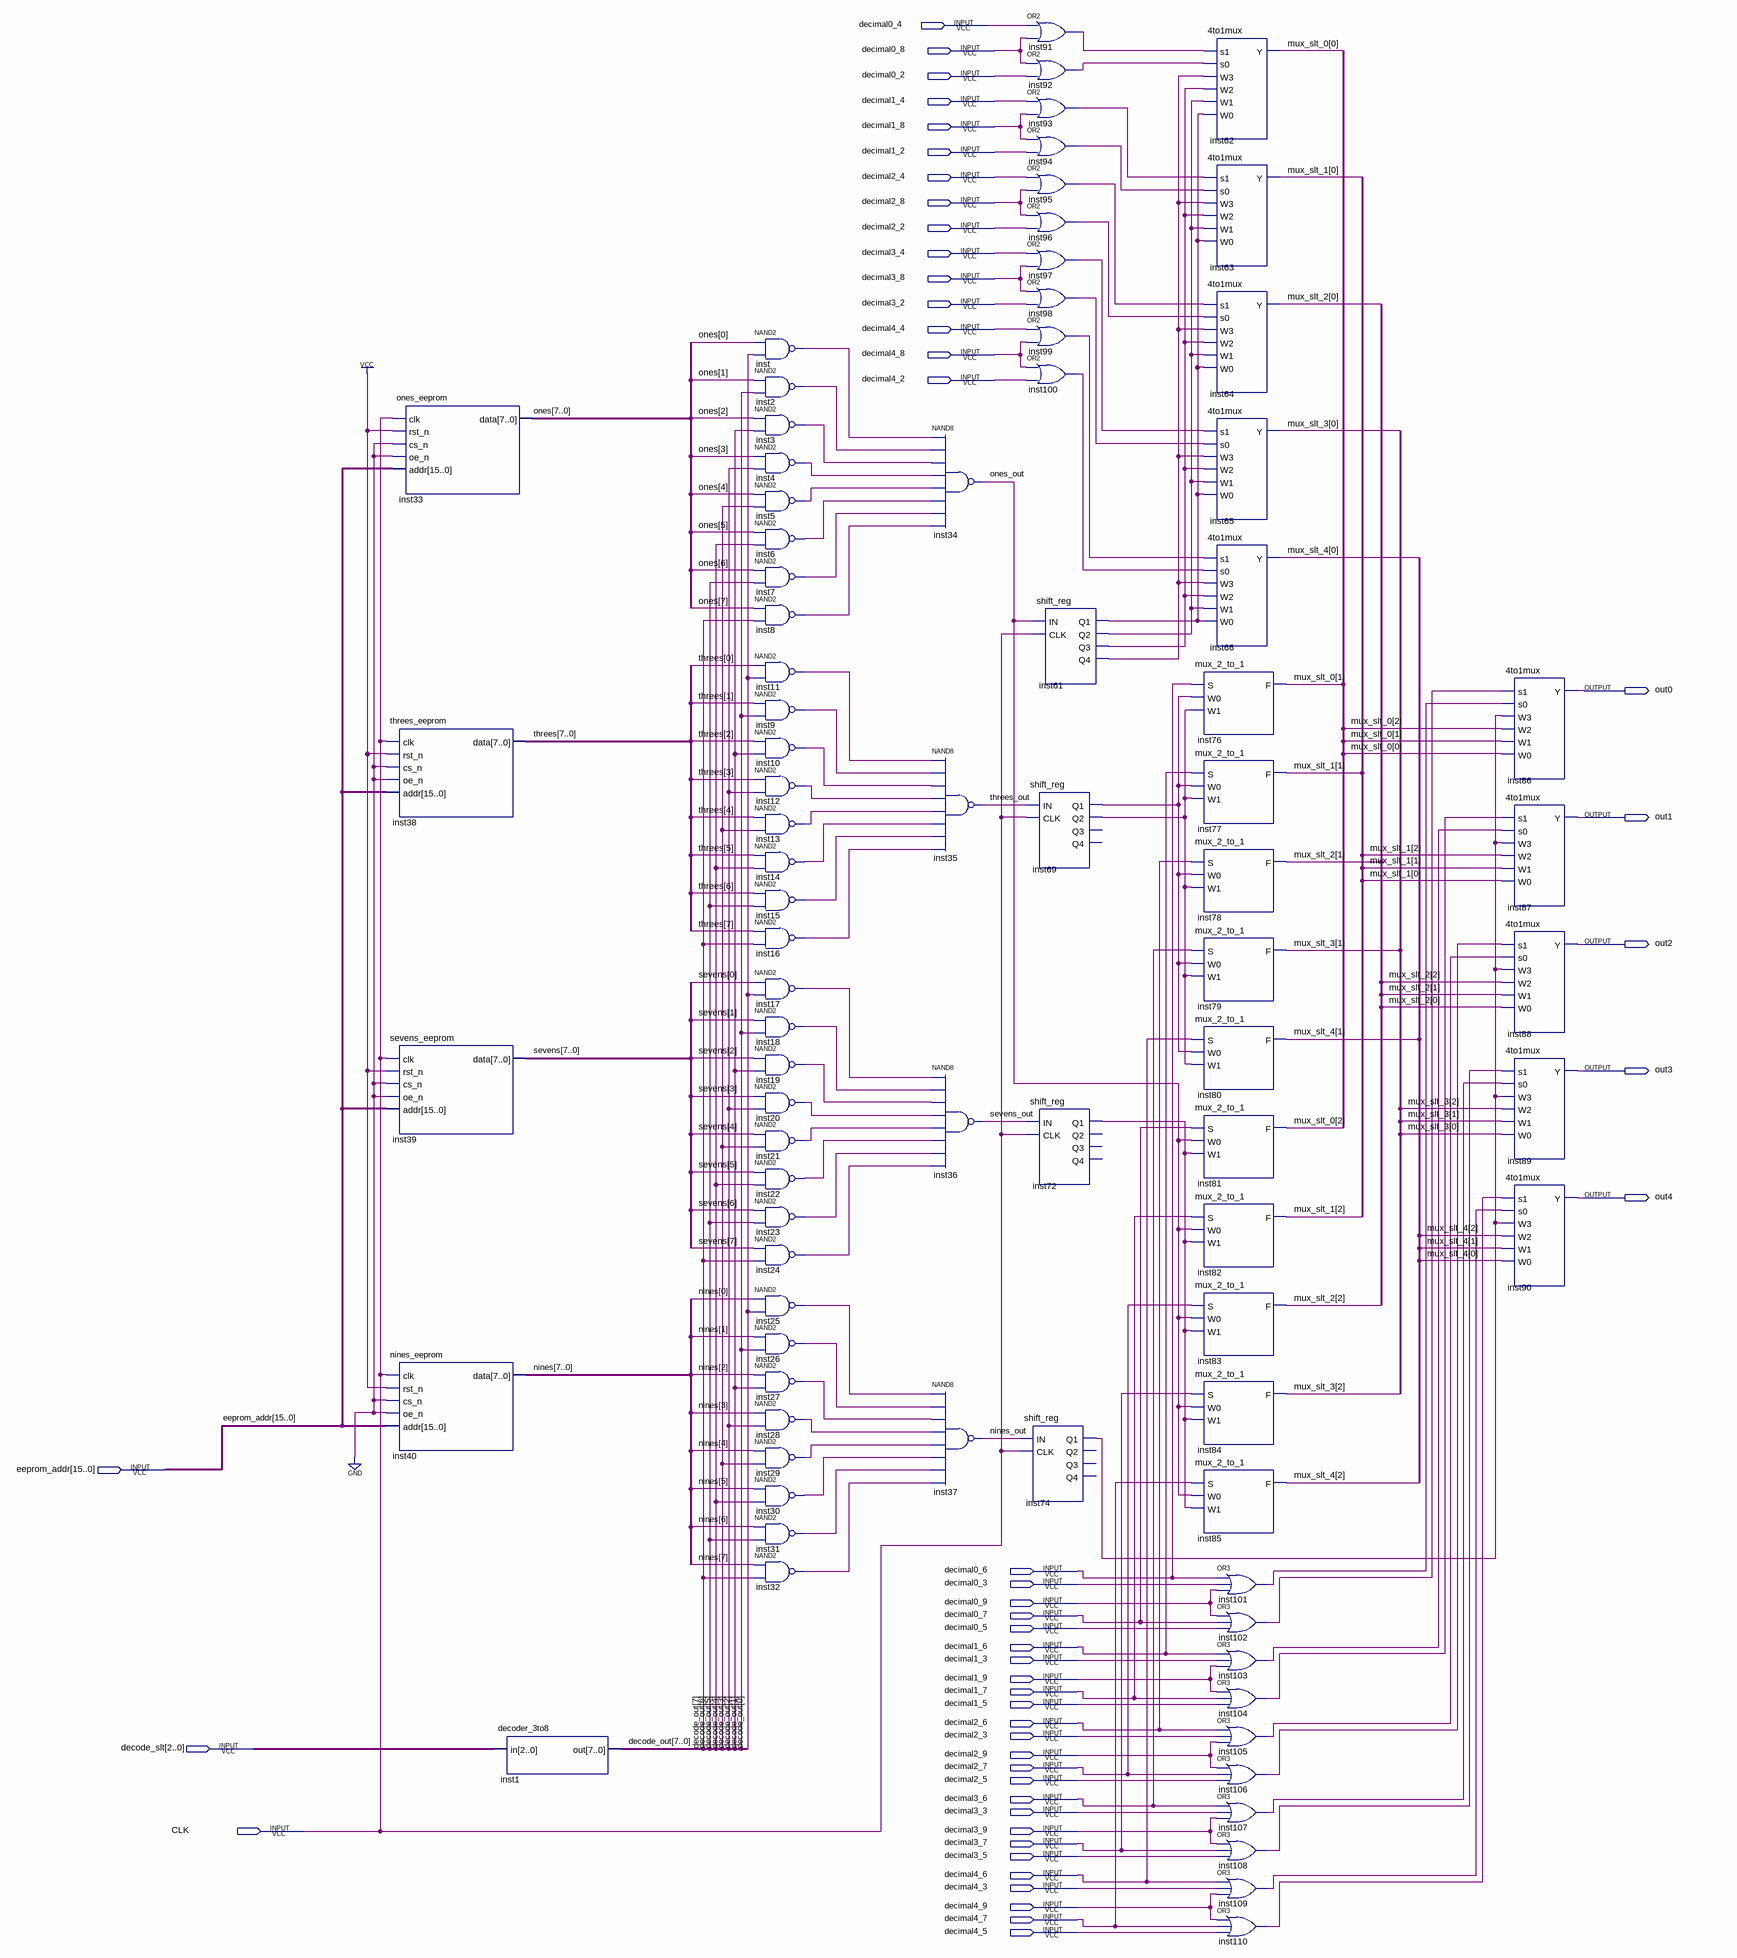
[diagram p0: schematic sheet]
// Quartus schematic base_conversion.bdf as structural Verilog: 85 symbols, 48 pins
module base_conversion (
  input  decimal0_4,
  input  decimal0_8,
  input  decimal0_2,
  input  decimal1_4,
  input  decimal1_8,
  input  decimal1_2,
  input  decimal2_4,
  input  decimal2_8,
  input  decimal2_2,
  input  decimal3_4,
  input  decimal3_8,
  input  decimal3_2,
  input  decimal4_4,
  input  decimal4_8,
  input  decimal4_2,
  input  [15:0] eeprom_addr,
  input  decimal0_6,
  input  decimal0_3,
  input  decimal0_9,
  input  decimal0_7,
  input  decimal0_5,
  input  decimal1_6,
  input  decimal1_3,
  input  decimal1_9,
  input  decimal1_7,
  input  decimal1_5,
  input  decimal2_6,
  input  decimal2_3,
  input  [2:0] decode_slt,
  input  decimal2_9,
  input  decimal2_7,
  input  decimal2_5,
  input  decimal3_6,
  input  decimal3_3,
  input  CLK,
  input  decimal3_9,
  input  decimal3_7,
  input  decimal3_5,
  input  decimal4_6,
  input  decimal4_3,
  input  decimal4_9,
  input  decimal4_7,
  input  decimal4_5,
  output out0,
  output out1,
  output out2,
  output out3,
  output out4
);

  wire inst2_out, inst3_out, inst4_out, inst5_out, inst6_out, inst7_out, inst8_out, inst9_out, inst10_out,
       inst11_out, inst12_out, inst13_out, inst14_out, inst15_out, inst16_out, inst17_out, inst18_out,
       inst19_out, inst20_out, inst21_out, inst22_out, inst23_out, inst24_out, inst25_out, inst26_out,
       inst27_out, inst28_out, inst29_out, inst30_out, inst31_out, inst32_out, inst61_q1, inst61_q2,
       inst61_q3, inst61_q4, inst69_q1, inst69_q2, inst72_q1, inst74_q1, inst91_out, inst92_out, inst93_out,
       inst94_out, inst95_out, inst96_out, inst97_out, inst98_out, inst99_out, inst100_out, inst101_out,
       inst102_out, inst103_out, inst104_out, inst105_out, inst106_out, inst107_out, inst108_out,
       inst109_out, inst110_out, inst_out, nines_out, ones_out, sevens_out, threes_out;
  wire [2:0] mux_slt_0, mux_slt_1, mux_slt_2, mux_slt_3, mux_slt_4;
  wire [7:0] decode_out, nines, ones, sevens, threes;

  ones_eeprom inst33 (.clk(CLK), .rst_n(1'b1), .cs_n(1'b0), .oe_n(1'b0), .addr(eeprom_addr), .data(ones));
  threes_eeprom inst38 (.clk(CLK), .rst_n(1'b1), .cs_n(1'b0), .oe_n(1'b0), .addr(eeprom_addr), .data(threes));
  sevens_eeprom inst39 (.clk(CLK), .rst_n(1'b1), .cs_n(1'b0), .oe_n(1'b0), .addr(eeprom_addr), .data(sevens));
  nines_eeprom inst40 (.clk(CLK), .rst_n(1'b1), .cs_n(1'b0), .oe_n(1'b0), .addr(eeprom_addr), .data(nines));
  decoder_3to8 inst1 (.in(decode_slt), .out(decode_out));
  nand inst (inst_out, ones[0], decode_out[0]);
  nand inst2 (inst2_out, ones[1], decode_out[1]);
  nand inst3 (inst3_out, ones[2], decode_out[2]);
  nand inst4 (inst4_out, ones[3], decode_out[3]);
  nand inst5 (inst5_out, ones[4], decode_out[4]);
  nand inst6 (inst6_out, ones[5], decode_out[5]);
  nand inst7 (inst7_out, ones[6], decode_out[6]);
  nand inst8 (inst8_out, ones[7], decode_out[7]);
  nand inst11 (inst11_out, threes[0], decode_out[0]);
  nand inst9 (inst9_out, threes[1], decode_out[1]);
  nand inst10 (inst10_out, threes[2], decode_out[2]);
  nand inst12 (inst12_out, threes[3], decode_out[3]);
  nand inst13 (inst13_out, threes[4], decode_out[4]);
  nand inst14 (inst14_out, threes[5], decode_out[5]);
  nand inst15 (inst15_out, threes[6], decode_out[6]);
  nand inst16 (inst16_out, threes[7], decode_out[7]);
  nand inst17 (inst17_out, sevens[0], decode_out[0]);
  nand inst18 (inst18_out, sevens[1], decode_out[1]);
  nand inst19 (inst19_out, sevens[2], decode_out[2]);
  nand inst20 (inst20_out, sevens[3], decode_out[3]);
  nand inst21 (inst21_out, sevens[4], decode_out[4]);
  nand inst22 (inst22_out, sevens[5], decode_out[5]);
  nand inst23 (inst23_out, sevens[6], decode_out[6]);
  nand inst24 (inst24_out, sevens[7], decode_out[7]);
  nand inst25 (inst25_out, nines[0], decode_out[0]);
  nand inst26 (inst26_out, nines[1], decode_out[1]);
  nand inst27 (inst27_out, nines[2], decode_out[2]);
  nand inst28 (inst28_out, nines[3], decode_out[3]);
  nand inst29 (inst29_out, nines[4], decode_out[4]);
  nand inst30 (inst30_out, nines[5], decode_out[5]);
  nand inst31 (inst31_out, nines[6], decode_out[6]);
  nand inst32 (inst32_out, nines[7], decode_out[7]);
  nand inst34 (ones_out, inst_out, inst2_out, inst3_out, inst4_out, inst5_out, inst6_out, inst7_out, inst8_out);
  nand inst35 (threes_out, inst11_out, inst9_out, inst10_out, inst12_out, inst13_out, inst14_out, inst15_out, inst16_out);
  nand inst36 (sevens_out, inst17_out, inst18_out, inst19_out, inst20_out, inst21_out, inst22_out, inst23_out, inst24_out);
  nand inst37 (nines_out, inst25_out, inst26_out, inst27_out, inst28_out, inst29_out, inst30_out, inst31_out, inst32_out);
  or inst91 (inst91_out, decimal0_4, decimal0_8);
  or inst92 (inst92_out, decimal0_8, decimal0_2);
  or inst93 (inst93_out, decimal1_4, decimal1_8);
  or inst94 (inst94_out, decimal1_8, decimal1_2);
  or inst95 (inst95_out, decimal2_4, decimal2_8);
  or inst96 (inst96_out, decimal2_8, decimal2_2);
  or inst97 (inst97_out, decimal3_4, decimal3_8);
  or inst98 (inst98_out, decimal3_8, decimal3_2);
  or inst99 (inst99_out, decimal4_4, decimal4_8);
  or inst100 (inst100_out, decimal4_8, decimal4_2);
  shift_reg inst61 (.IN(ones_out), .CLK(CLK), .Q1(inst61_q1), .Q2(inst61_q2), .Q3(inst61_q3), .Q4(inst61_q4));
  shift_reg inst69 (.IN(threes_out), .CLK(CLK), .Q1(inst69_q1), .Q2(inst69_q2));  // open: Q3, Q4
  shift_reg inst72 (.IN(sevens_out), .CLK(CLK), .Q1(inst72_q1));  // open: Q2, Q3, Q4
  shift_reg inst74 (.IN(nines_out), .CLK(CLK), .Q1(inst74_q1));  // open: Q2, Q3, Q4
  \4to1mux  inst62 (
    .s1(inst91_out), .s0(inst92_out), .W3(inst61_q4), .W2(inst61_q3), .W1(inst61_q2), .W0(inst61_q1),
    .Y(mux_slt_0[0]));
  \4to1mux  inst63 (
    .s1(inst93_out), .s0(inst94_out), .W3(inst61_q4), .W2(inst61_q3), .W1(inst61_q2), .W0(inst61_q1),
    .Y(mux_slt_1[0]));
  \4to1mux  inst64 (
    .s1(inst95_out), .s0(inst96_out), .W3(inst61_q4), .W2(inst61_q3), .W1(inst61_q2), .W0(inst61_q1),
    .Y(mux_slt_2[0]));
  \4to1mux  inst65 (
    .s1(inst97_out), .s0(inst98_out), .W3(inst61_q4), .W2(inst61_q3), .W1(inst61_q2), .W0(inst61_q1),
    .Y(mux_slt_3[0]));
  \4to1mux  inst66 (
    .s1(inst99_out), .s0(inst100_out), .W3(inst61_q4), .W2(inst61_q3), .W1(inst61_q2), .W0(inst61_q1),
    .Y(mux_slt_4[0]));
  mux_2_to_1 inst76 (.S(decimal0_6), .W0(inst69_q1), .W1(inst69_q2), .F(mux_slt_0[1]));
  mux_2_to_1 inst77 (.S(decimal1_6), .W0(inst69_q1), .W1(inst69_q2), .F(mux_slt_1[1]));
  mux_2_to_1 inst78 (.S(decimal2_6), .W0(inst69_q1), .W1(inst69_q2), .F(mux_slt_2[1]));
  mux_2_to_1 inst79 (.S(decimal3_6), .W0(inst69_q1), .W1(inst69_q2), .F(mux_slt_3[1]));
  mux_2_to_1 inst80 (.S(decimal4_6), .W0(inst69_q1), .W1(inst69_q2), .F(mux_slt_4[1]));
  mux_2_to_1 inst81 (.S(decimal0_7), .W0(ones_out), .W1(inst72_q1), .F(mux_slt_0[2]));
  mux_2_to_1 inst82 (.S(decimal1_7), .W0(ones_out), .W1(inst72_q1), .F(mux_slt_1[2]));
  mux_2_to_1 inst83 (.S(decimal2_7), .W0(ones_out), .W1(inst72_q1), .F(mux_slt_2[2]));
  mux_2_to_1 inst84 (.S(decimal3_7), .W0(ones_out), .W1(inst72_q1), .F(mux_slt_3[2]));
  mux_2_to_1 inst85 (.S(decimal4_7), .W0(ones_out), .W1(inst72_q1), .F(mux_slt_4[2]));
  or inst101 (inst101_out, decimal0_6, decimal0_3, decimal0_9);
  or inst102 (inst102_out, decimal0_9, decimal0_7, decimal0_5);
  or inst103 (inst103_out, decimal1_6, decimal1_3, decimal1_9);
  or inst104 (inst104_out, decimal1_9, decimal1_7, decimal1_5);
  or inst105 (inst105_out, decimal2_6, decimal2_3, decimal2_9);
  or inst106 (inst106_out, decimal2_9, decimal2_7, decimal2_5);
  or inst107 (inst107_out, decimal3_6, decimal3_3, decimal3_9);
  or inst108 (inst108_out, decimal3_9, decimal3_7, decimal3_5);
  or inst109 (inst109_out, decimal4_6, decimal4_3, decimal4_9);
  or inst110 (inst110_out, decimal4_9, decimal4_7, decimal4_5);
  \4to1mux  inst86 (
    .s1(inst102_out), .s0(inst101_out), .W3(inst74_q1), .W2(mux_slt_0[2]), .W1(mux_slt_0[1]),
    .W0(mux_slt_0[0]), .Y(out0));
  \4to1mux  inst87 (
    .s1(inst104_out), .s0(inst103_out), .W3(inst74_q1), .W2(mux_slt_1[2]), .W1(mux_slt_1[1]),
    .W0(mux_slt_1[0]), .Y(out1));
  \4to1mux  inst88 (
    .s1(inst106_out), .s0(inst105_out), .W3(inst74_q1), .W2(mux_slt_2[2]), .W1(mux_slt_2[1]),
    .W0(mux_slt_2[0]), .Y(out2));
  \4to1mux  inst89 (
    .s1(inst108_out), .s0(inst107_out), .W3(inst74_q1), .W2(mux_slt_3[2]), .W1(mux_slt_3[1]),
    .W0(mux_slt_3[0]), .Y(out3));
  \4to1mux  inst90 (
    .s1(inst110_out), .s0(inst109_out), .W3(inst74_q1), .W2(mux_slt_4[2]), .W1(mux_slt_4[1]),
    .W0(mux_slt_4[0]), .Y(out4));
endmodule
